# Altium schematic sheet Stepping Motor DriverE.SchDoc
size A4
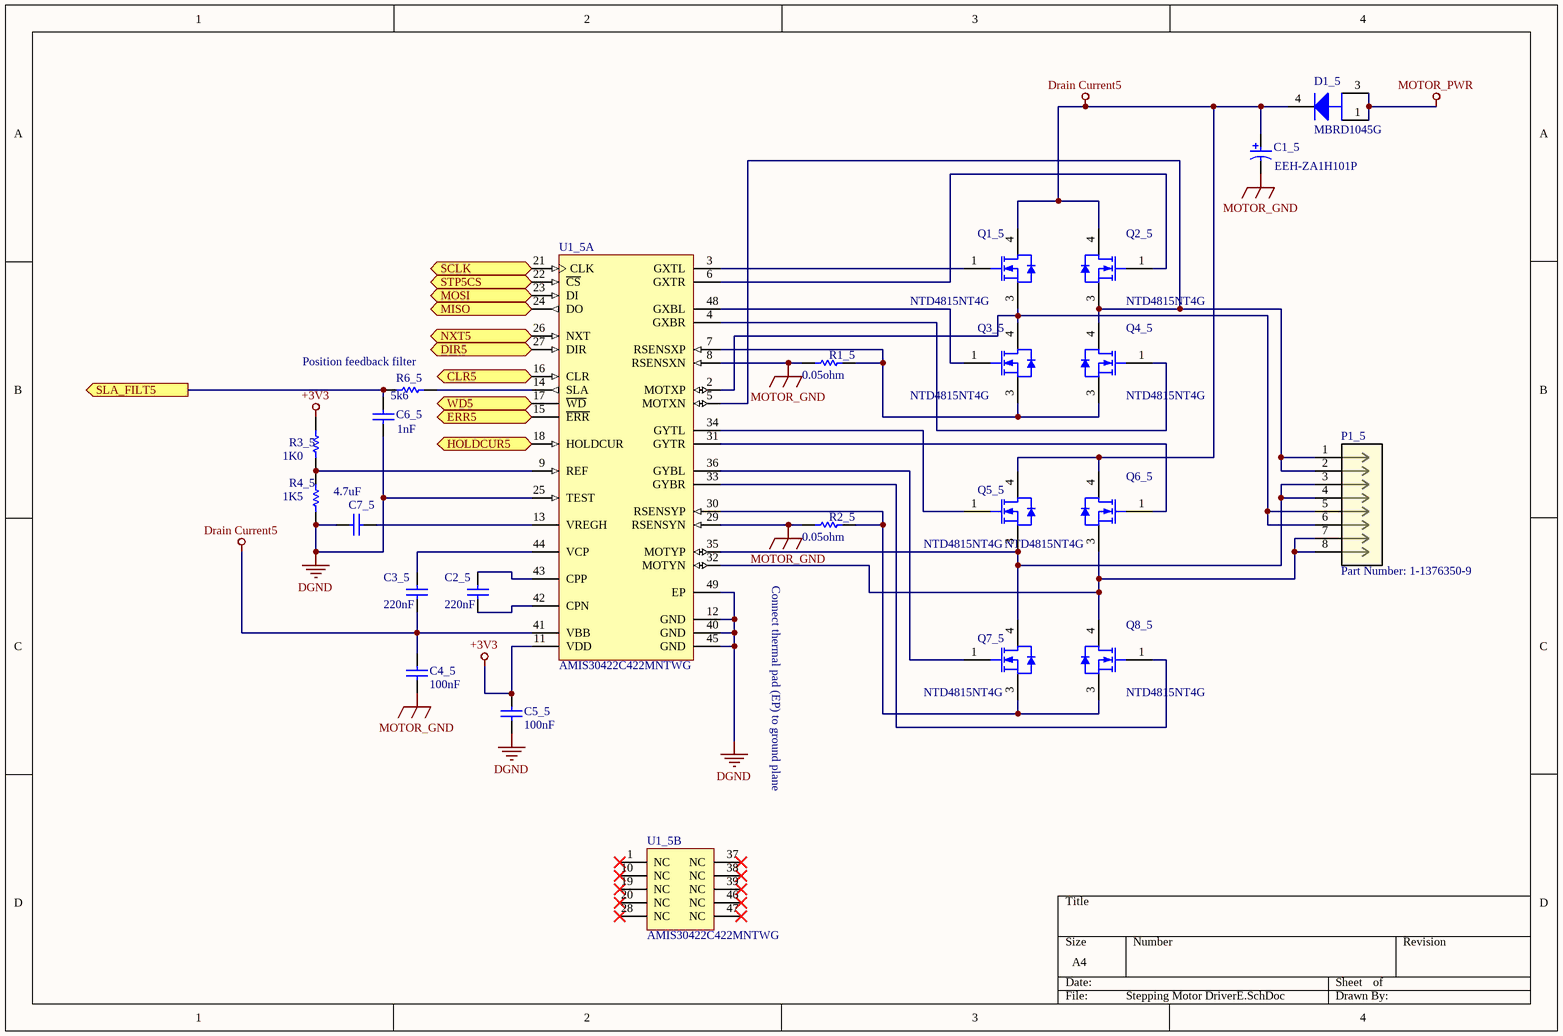
[diagram p0: Stepping Motor DriverE.SchDoc]

## Parts
C1_5  EEH-ZA1H101P  [PNSC-ZA-G_L]
C2_5  value 220nF  [CAPC0805(2012)75_L]  (hidden comment: CAP 220nF 50V 0805(2012))
C3_5  value 220nF  [CAPC0805(2012)75_L]  (hidden comment: CAP 220nF 50V 0805(2012))
C4_5  value 100nF  [CAPC1812(4532)110_N]  (hidden comment: CAP 100nF 50V 1812(4532))
C5_5  value 100nF  [CAPC1812(4532)110_N]  (hidden comment: CAP 100nF 50V 1812(4532))
C6_5  value 1nF  [CAPC1206(3216)170_N]  (hidden comment: CAP 1nF 50V 1206(3216))
C7_5  value 4.7uF  [CAPC2220(5750)230_L]  (hidden comment: CAP 4.7uF 50V 2220(5750))
D1_5  MBRD1045G  [ONSC-DPAK-3-369C-01_V]
P1_5  Part Number: 1-1376350-9  [conn8_1-1376350-]
Q1_5  NTD4815NT4G  [ONSC-DPAK-3-369AA-01_V]
Q2_5  NTD4815NT4G  [ONSC-DPAK-3-369AA-01_V]
Q3_5  NTD4815NT4G  [ONSC-DPAK-3-369AA-01_V]
Q4_5  NTD4815NT4G  [ONSC-DPAK-3-369AA-01_V]
Q5_5  NTD4815NT4G  [ONSC-DPAK-3-369AA-01_V]
Q6_5  NTD4815NT4G  [ONSC-DPAK-3-369AA-01_V]
Q7_5  NTD4815NT4G  [ONSC-DPAK-3-369AA-01_V]
Q8_5  NTD4815NT4G  [ONSC-DPAK-3-369AA-01_V]
R1_5  Resistance: 0.05ohm  [RESC6432X89X76LL25T25]  (hidden comment: WSL2512R0500FEA)
R2_5  Resistance: 0.05ohm  [RESC6432X89X76LL25T25]  (hidden comment: WSL2512R0500FEA)
R3_5  value 1K0  [RESC0805(2012)_M]  (hidden comment: 1K 1% 0805(2012))
R4_5  value 1K5  [RESC0805(2012)_M]  (hidden comment: 1K5 1% 0805(2012))
R6_5  value 5k6  [RESC0805(2012)_L]  (hidden comment: 5K6 1% 0805(2012))
U1_5  AMIS30422C422MNTWG  [ONSC-QFN-48-485AJ-01_V]  (parts A,B of 2)

## Ports
CLR5 (in), DIR5 (in), ERR5 (out), HOLDCUR5 (in), MISO (out), MOSI (in), NXT5 (in), SCLK (in), SLA_FILT5 (out), STP5CS (in), WD5 (out)

## Nets
+3V3: C5_5.2 R3_5.2 U1_5.11(VDD)
DGND: C5_5.1 C6_5.1 C7_5.1 R4_5.1 U1_5.12(GND) U1_5.25(TEST) U1_5.40(GND) U1_5.45(GND) U1_5.49(EP)
Drain Current5: C1_5.1 C3_5.1 C4_5.2 D1_5.4(K) Q1_5.4(D) Q2_5.4(D) Q5_5.4(D) Q6_5.4(D) U1_5.41(VBB)
MOTOR_GND: C1_5.2 C4_5.1 R1_5.1 R2_5.1 U1_5.8(RSENSXN) U1_5.29(RSENSYN)
MOTOR_PWR: D1_5.1(A) D1_5.3(A)
CLR5: U1_5.16(CLR) ; port CLR5
DIR5: U1_5.27(DIR) ; port DIR5
ERR5: U1_5.15(~{ERR}) ; port ERR5
HOLDCUR5: U1_5.18(HOLDCUR) ; port HOLDCUR5
MISO: U1_5.24(DO) ; port MISO
MOSI: U1_5.23(DI) ; port MOSI
NXT5: U1_5.26(NXT) ; port NXT5
SCLK: U1_5.21(CLK) ; port SCLK
SLA_FILT5: C6_5.2 R6_5.1 ; port SLA_FILT5
STP5CS: U1_5.22(~{CS}) ; port STP5CS
WD5: U1_5.17(~{WD}) ; port WD5
NetC2_5_1: C2_5.1 U1_5.42(CPN)
NetC2_5_2: C2_5.2 U1_5.43(CPP)
NetC3_5_2: C3_5.2 U1_5.44(VCP)
NetC7_5_2: C7_5.2 U1_5.13(VREGH)
NetP1_5_1: P1_5.1 P1_5.2 Q2_5.3(S) Q4_5.4(D) U1_5.5(MOTXN)
NetP1_5_3: P1_5.3 P1_5.4 Q5_5.3(S) Q7_5.4(D) U1_5.35(MOTYP)
NetP1_5_5: P1_5.5 P1_5.6 Q1_5.3(S) Q3_5.4(D) U1_5.2(MOTXP)
NetP1_5_7: P1_5.7 P1_5.8 Q6_5.3(S) Q8_5.4(D) U1_5.32(MOTYN)
NetQ1_5_1: Q1_5.1(G) U1_5.3(GXTL)
NetQ2_5_1: Q2_5.1(G) U1_5.6(GXTR)
NetQ3_5_1: Q3_5.1(G) U1_5.48(GXBL)
NetQ3_5_3: Q3_5.3(S) Q4_5.3(S) R1_5.2 U1_5.7(RSENSXP)
NetQ4_5_1: Q4_5.1(G) U1_5.4(GXBR)
NetQ5_5_1: Q5_5.1(G) U1_5.34(GYTL)
NetQ6_5_1: Q6_5.1(G) U1_5.31(GYTR)
NetQ7_5_1: Q7_5.1(G) U1_5.36(GYBL)
NetQ7_5_3: Q7_5.3(S) Q8_5.3(S) R2_5.2 U1_5.30(RSENSYP)
NetQ8_5_1: Q8_5.1(G) U1_5.33(GYBR)
NetR3_5_1: R3_5.1 R4_5.2 U1_5.9(REF)
NetR6_5_2: R6_5.2 U1_5.14(SLA)

Not connected (* = marked no-connect by the designer): U1_5 1(NC)* 10(NC)* 19(NC)* 20(NC)* 28(NC)* 37(NC)* 38(NC)* 39(NC)* 46(NC)* 47(NC)*

## Notes on the sheet
- (near R6_5) Position feedback filter
- Connect thermal pad (EP) to ground plane

## Library data of the parts
C1_5 = CMP-2000-06221-1: Conductive Polymer Hybrid Aluminum Electrolytic Capacitor, 100 uF, +/- 20%, 50 V, -55 to 105 degC, 2-Pin SMD (G), RoHS, Tape and Reel; Case Height: 10.5mm; Voltage Rating DC: 50V; Case Diameter: 10mm; Ripple Current: 2A; Load Life: 10000Hour; Brand: Panasonic; Case Length: 10.2mm; ESR: 28mOhms; Capacitance: 100uF; Manufacturer URL: http://www.panasonic.com/; Minimum Operating Temperature: -55C; Datasheet Version: 06/2016; Product Category: AluminumOrganicPolymerCapacitors; Maximum Operating Temperature: +105C; Package Description: 2-Pin Surface Mount Device, Body 10.3 x 10.3 mm; Package Reference: ZA-G; RoHS: Details; Series: ZA; Tolerance: 20%; Product: AluminumElectrolyticCapacitors; Factory Pack Quantity: 500; Manufacturer: Panasonic; Termination Style: SMD/SMT; Datasheet URL: https://industrial.panasonic.com/cdbs/www-data/pdf/RDD0000/DMD0000COL56.pdf; Mounting Technology: SurfaceMount; Packaging: Reel; Height: 10.5mm
C2_5 C3_5 = CMP-1036-04556-1: CAP 220nF 50V -20% to +80% 0805 (2012 Metric) Thickness 0.75mm SMD; Case-Metric: 2012; Case-EIA: 0805; Technology: SMT; Max Thickness: 0.75 mm; Rated Voltage: 50 V; Tolerance: -20% to +80%
C4_5 C5_5 = CMP-1040-01292-1: CAP 100nF 50V ±20% 1812 (4532 Metric) Thickness 1.1mm SMD; Case-EIA: 1812; Tolerance: Â±20%; Case-Metric: 4532; Rated Voltage: 50 V; Technology: SMT; Max Thickness: 1.1 mm
C6_5 = CMP-1037-02447-1: CAP 1nF 50V ±2% 1206 (3216 Metric) Thickness 1.7mm SMD; Case-Metric: 3216; Case-EIA: 1206; Tolerance: Â±2%; Technology: SMT; Max Thickness: 1.7 mm; Rated Voltage: 50 V
C7_5 = CMP-1042-00755-1: CAP 4.7uF 50V ±10% 2220 (5750 Metric) Thickness 2.2mm SMD; Case-Metric: 5750; Tolerance: Â±10%; Case-EIA: 2220; Rated Voltage: 50 V; Max Thickness: 2.2 mm; Technology: SMT
D1_5 = CMP-1055-00174-1: SWITCHMODE(TM) Schottky Power Rectifier, 3-Pin DPAK, Pb-Free, Tube; Manufacturer: On Semiconductor; Note1: 0; IFSM Max (A): 70; Configuration: Single; ComponentLink2URL: http://www.onsemi.cn/pub_link/Collateral/MBRB1045-D.PDF; PackageVersion: Rev. E, 02/2014; PackageDescription: 3-Pin Flange Mount, Body 6.54 x 6.095 mm, Pitch 2.29 mm; ComponentLink2Description: Datasheet; Packing: Tube; RoHS: TRUE; ComponentLink3Description: Package Specification; PackageReference: DPAK-3-369C-01; ComponentLink1URL: http://www.onsemi.com/; DatasheetVersion: Rev. 8; ComponentLink1Description: Manufacturer URL; PartNumber: MBRD1045G; Mounting Technology: Surface Mount; ComponentLink3URL: http://www.onsemi.cn/pub_link/Collateral/369C.PDF
P1_5 = 1-1376350-9: 025 8POS CAP ASSY H TIN; Vendor: TE Connectivity; Built_By: Digital_Papaya_Team; ROWS/CONFIG: 2; PITCH(MM): 0.087; POSITIONS: 8; Copyright: Copyright (C) 2018 Accelerated Designs. All rights reserved; Manufacturer_Part_Number: 1-1376350-9; Datasheet: https://www.te.com/commerce/DocumentDelivery/DDEController?Action=showdoc&DocId=Customer+Drawing%7F1376350%7FD5%7Fpdf%7FJapanese%7FJPN_CD_1376350_D5.pdf%7F1-1376350-2; TE_Part_Number: 1-1376350-9; PRODUCT: -; Type: DEV; RefDes: RefDes; Value: Value
Q1_5 Q2_5 Q3_5 Q4_5 Q5_5 Q6_5 Q7_5 Q8_5 = CMP-1058-00298-1: Power MOSFET, 30 V, 35 A, Single N-Channel, 3-Pin DPAK, Pb-Free, Tape and Reel; Manufacturer: On Semiconductor; VGS(th) Max (V): 2.5; VGS Max (V): 20; ID Max (A): 35; Crss Typ (pF): 108; Coss Typ (pF): 181; Channel Polarity: N Channel; V(BR)DSS Min (V): 30; Ciss Typ (pF): 770; Qrr Typ (nC): 5.5; RoHS: Pb-Free; ComponentLink3Description: Package Specification; ComponentLink2URL: http://www.onsemi.cn/pub_link/Collateral/NTD4815N-D.PDF; ComponentLink1Description: Manufacturer URL; DatasheetVersion: Rev. 7; ComponentLink3URL: http://www.onsemi.cn/pub_link/Collateral/369AA.PDF; Package Type: DPAK-3, IPAK-3; PartNumber: NTD4815NT4G; Configuration: Single; PackageVersion: Rev. B, 06/2010; ComponentLink2Description: Datasheet; Mounting Technology: Surface Mount; PackageReference: DPAK-3-369AA-01; ComponentLink1URL: http://www.onsemi.com/; PackageDescription: 3-Pin Flange Mount, Body 6.54 x 6.095 mm, Pitch 2.29 mm; Packing: Tape and Reel
R1_5 R2_5 = CMP-2000-07420-1: Chip Resistor, 50 mOhm, +/- 1%, 1 W, -65 to 170 degC, 2512 (6432 Metric), RoHS, Tape and Reel; Manufacturer: Vishay; Power Rating: 1W; Automotive Qualification Standard: AEC-Q200; Temperature Coefficient: ±75ppm/°C; Resistor Case Style: 2512[6432Metric]; SVHC: NoSVHC(15-Jun-2015); Product Range: WSLSeries; Resistor Element Type: MetalStrip; Manufacturer URL: http://www.vishay.com/; Datasheet Version: 07/2016; Package Reference: 2512; Resistance Tolerance: ±1%; Datasheet URL: http://www.vishay.com/docs/30100/wsl.pdf; Mounting Technology: SurfaceMount; MSL: MSL1-Unlimited; Package Description: 2-Pin Surface Mount Device, Body 6.35 x 3.18 mm; Packaging: CutTape
R3_5 = CMP-1013-00510-1: 1K 0.125W 1% 0805 (2012 Metric)  SMD; Case-Metric: 2012; Case-EIA: 0805; Tolerance: 1 %; Power: 0.125 W; Technology: SMT
R4_5 = CMP-1013-00528-1: 1K5 0.125W 1% 0805 (2012 Metric)  SMD; Case-Metric: 2012; Case-EIA: 0805; Technology: SMT; Power: 0.125 W; Tolerance: 1 %
R6_5 = CMP-1013-00595-1: 5K6 0.125W 1% 0805 (2012 Metric)  SMD; Case-EIA: 0805; Case-Metric: 2012; Technology: SMT; Power: 0.125 W; Tolerance: 1 %
U1_5 = CMP-1325-00002-1: Micro-Stepping Stepper Motor Bridge Controller, 6 to 30 V, -40 to 170 degC, 48-Pin QFN (485AJ-01), RoHS, Tape and Reel; Manufacturer: ON Semiconductor; IO Max (A): 15; Feedback Method: Back EMF/Sensorless; VCC Min (V): 6; IO Peak Max (A): 20; Current Sense: External Resistor; VCC Max (V): 30; ComponentLink1Description: Manufacturer URL; DatasheetVersion: Rev. 0; PackageDescription: 48-Pin Quad Flat No-Lead Package, Body 7 x 7 mm, Pitch 0.5 mm; Packing: Tape and Reel; Mounting Technology: Surface Mount; ComponentLink2Description: Datasheet; ComponentLink3URL: http://www.onsemi.cn/pub_link/Collateral/485AJ.PDF; Type: Stepper; ComponentLink2URL: http://www.onsemi.com/pub_link/Collateral/AMIS-30422-D.PDF; ComponentLink3Description: Package Specification; PackageReference: QFN-48-485AJ-01; PartNumber: AMIS30422C422MNTWG; PackageVersion: Rev. O; ComponentLink1URL: http://www.onsemi.com/; RoHS: TRUE; PartId: 1